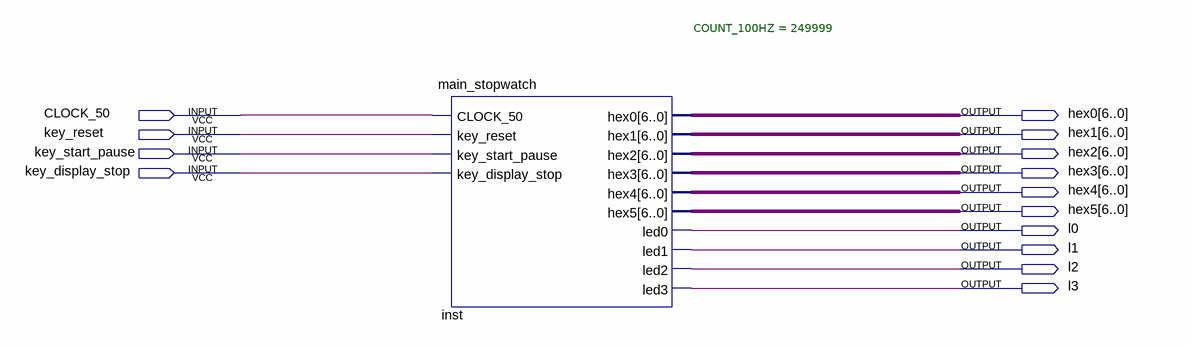
[diagram p0: schematic sheet]
// Quartus schematic stopwatch.bdf as structural Verilog: 1 symbols, 14 pins
module stopwatch (
  input  CLOCK_50,
  input  key_reset,
  input  key_start_pause,
  input  key_display_stop,
  output [6:0] hex0,
  output [6:0] hex1,
  output [6:0] hex2,
  output [6:0] hex3,
  output [6:0] hex4,
  output [6:0] hex5,
  output l0,
  output l1,
  output l2,
  output l3
);

  main_stopwatch #(.COUNT_100HZ(249999)) inst (
    .CLOCK_50(CLOCK_50), .key_reset(key_reset), .key_start_pause(key_start_pause),
    .key_display_stop(key_display_stop), .hex0(hex0), .hex1(hex1), .hex2(hex2), .hex3(hex3), .hex4(hex4),
    .hex5(hex5), .led0(l0), .led1(l1), .led2(l2), .led3(l3));
endmodule
